# EAGLE design BMP280_board (EAGLE 7.1.0)
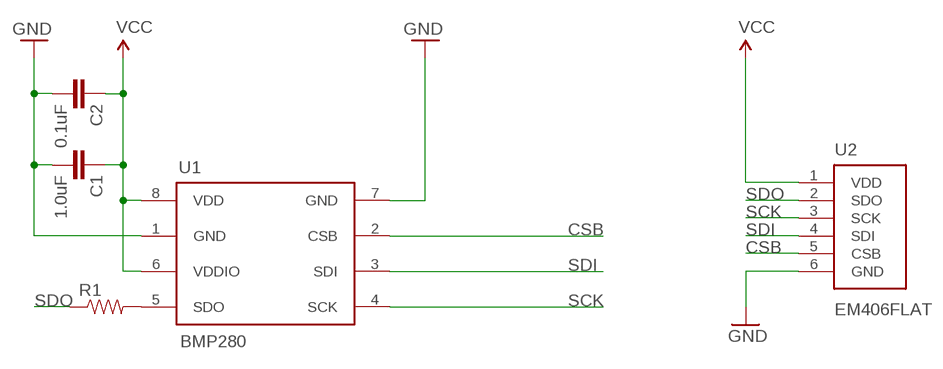
[diagram p0: schematic, sheet 1]

## Parts
C1  1.0uF  0.1UF-25V(+80/-20%)(0603)  [0603-CAP]
C2  0.1uF  0.1UF-25V(+80/-20%)(0603)  [0603-CAP]
R1  RESISTOR0603-RES  [0603-RES]
U1  BMP280  BMP280_PITCH0.65  [LGA-8]
U2  EM406FLAT  [EM406-FLAT]

## Nets
CSB: U1.2(CSB) U2.5(CSB)
GND: C1.2 C2.2 U1.1(GND) U1.7(GND) U2.6(GND)
N$1: R1.2 U1.5(SDO)
SCK: U1.4(SCK) U2.3(SCK)
SDI: U1.3(SDI) U2.4(SDI)
SDO: R1.1 U2.2(SDO)
VCC: C1.1 C2.1 U1.6(VDDIO) U1.8(VDD) U2.1(VDD)

## Library data of the parts
C1 = SparkFun-Capacitors:0.1UF-25V(+80/-20%)(0603): CAP-00810 Ceramic Standard decoupling cap; PROD_ID: CAP-00810; VALUE: 0.1uF
C2 = SparkFun-Capacitors:0.1UF-25V(+80/-20%)(0603): CAP-00810 Ceramic Standard decoupling cap; PROD_ID: CAP-00810
R1 = SparkFun-Passives:RESISTOR: Resistor Basic schematic elements and footprints for 0603, 1206, and PTH resistors.
U1 = icarus_sensors:BMP280: Bosch BMP280 presssure sensor
U2 = icarus_sensors:EM406: EM406 GPS Connector Proven layout and schematic for EM406 connector. Spark Fun Electronics SKU : GPS-00579

## Board
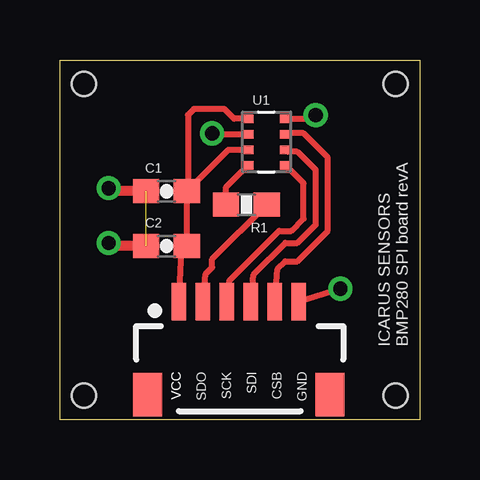
[diagram p1: board, top side]
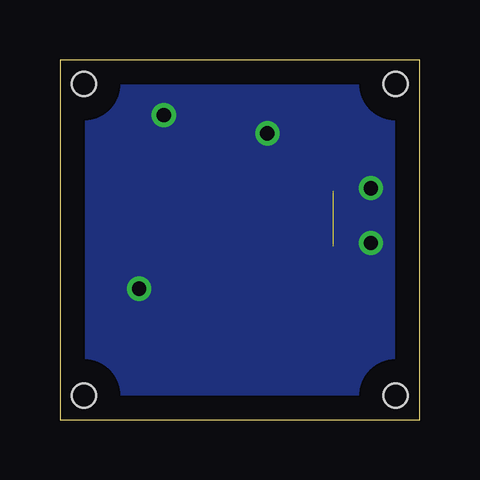
[diagram p2: board, bottom side, seen from below]

Size 15 x 15 mm. Coordinates in mm from the lower left corner, seen from the top.
Outline: 0,0 0,15 15,15 15,0 0,0
Copper layers (1*16): Top 0.035mm / dielectric 1.5mm / Bottom 0.035mm
Design rules "default": minimum track width 10mil, minimum drill 24mil, track to track 8mil, track to pad 8mil, pad to pad 8mil, via to via 8mil, smd to smd 8mil, copper to edge 40mil, drill to drill 8mil, minimum pad ring 10mil, minimum via ring 8mil, stop-mask expansion 4mil, vias tented up to drill 0mil, thermal gap 10mil
Holes 1 mm at 1,14 14,14 14,1 1,1

### Footprints (pad centres in the part's own frame; a part is rotated, then mirrored left to right if it is on the bottom)
0603-CAP = smd 1.1 x 1: 1 -0.85,0; 2 0.85,0
0603-RES = smd 1.1 x 1: 1 -0.85,0; 2 0.85,0
LGA-8 = smd 0.5 x 0.35: 1 0.8,0.975; 2 0.8,0.325; 3 0.8,-0.325; 4 0.8,-0.975; 5 -0.8,-0.975; 6 -0.8,-0.325; 7 -0.8,0.325; 8 -0.8,0.975
EM406-FLAT = smd 0.6 x 1.55: 1 -2.54,2.92; 2 -1.54,2.92; 3 -0.54,2.92; 4 0.46,2.92; 5 1.46,2.92; 6 2.46,2.92 | smd 1.2 x 1.8: P$1 -3.84,-0.955; P$2 3.76,-0.955

### Placement (x,y rotation side)
C1  4.45,9.53 180 top
C2  4.45,7.24 180 top
R1  7.78,8.97 180 top
U1  8.62,11.57 0 top
U2  7.5,2 0 top

### Tracks (layer width: path | path; a pad name or v marks a point on that pad's centre or on a via)
CSB
  Top 0.254: U2.5 9.08,6.28 9.4,6.6 9.91,6.6 11.18,7.87 11.18,10.92 10.16,11.94 9.46,11.94 U1.2
GND  (via drill 0.6)  (1 unrouted)
  Top 0.254: U2.6 v11.7,5.46 | 6.39,11.9 U1.7 | U1.1 10.52,12.55
  Top 0.406: 6.39,11.9 v6.35,11.94 | 10.52,12.55 v10.67,12.7 | C1.2 2.16,9.53 v2.03,9.65 | C2.2 2.16,7.24 v2.03,7.37
  pour Bottom: 0.76,14.53 0.51,0.76 14.27,0.76 14.53,14.53
N$1
  Top 0.254: R1.2 6.93,9.71 U1.5
SCK
  Top 0.254: U2.3 7.08,5.81 9.14,7.87 9.65,7.87 10.16,8.38 10.16,9.86 U1.4
SDI
  Top 0.254: U2.4 8.08,6.04 9.4,7.37 9.91,7.37 10.67,8.13 10.67,10.41 9.91,11.18 9.49,11.18 U1.3
SDO
  Top 0.254: U2.2 6.08,6.08 6.35,6.35 6.35,6.69 R1.1
VCC
  Top 0.254: C1.1 C2.1 5.08,7.02 U2.1 | 5.08,9.56 C1.1 | U1.8 7.26,12.55 6.86,12.95 5.59,12.95 5.33,12.7 5.33,9.56 C1.1 | U1.6 7.02,11.25 C1.1

### Text on the board
tNames: ICARUS SENSORS / BMP280 SPI board revA